# Altium project power_distrubtion.PrjPCB
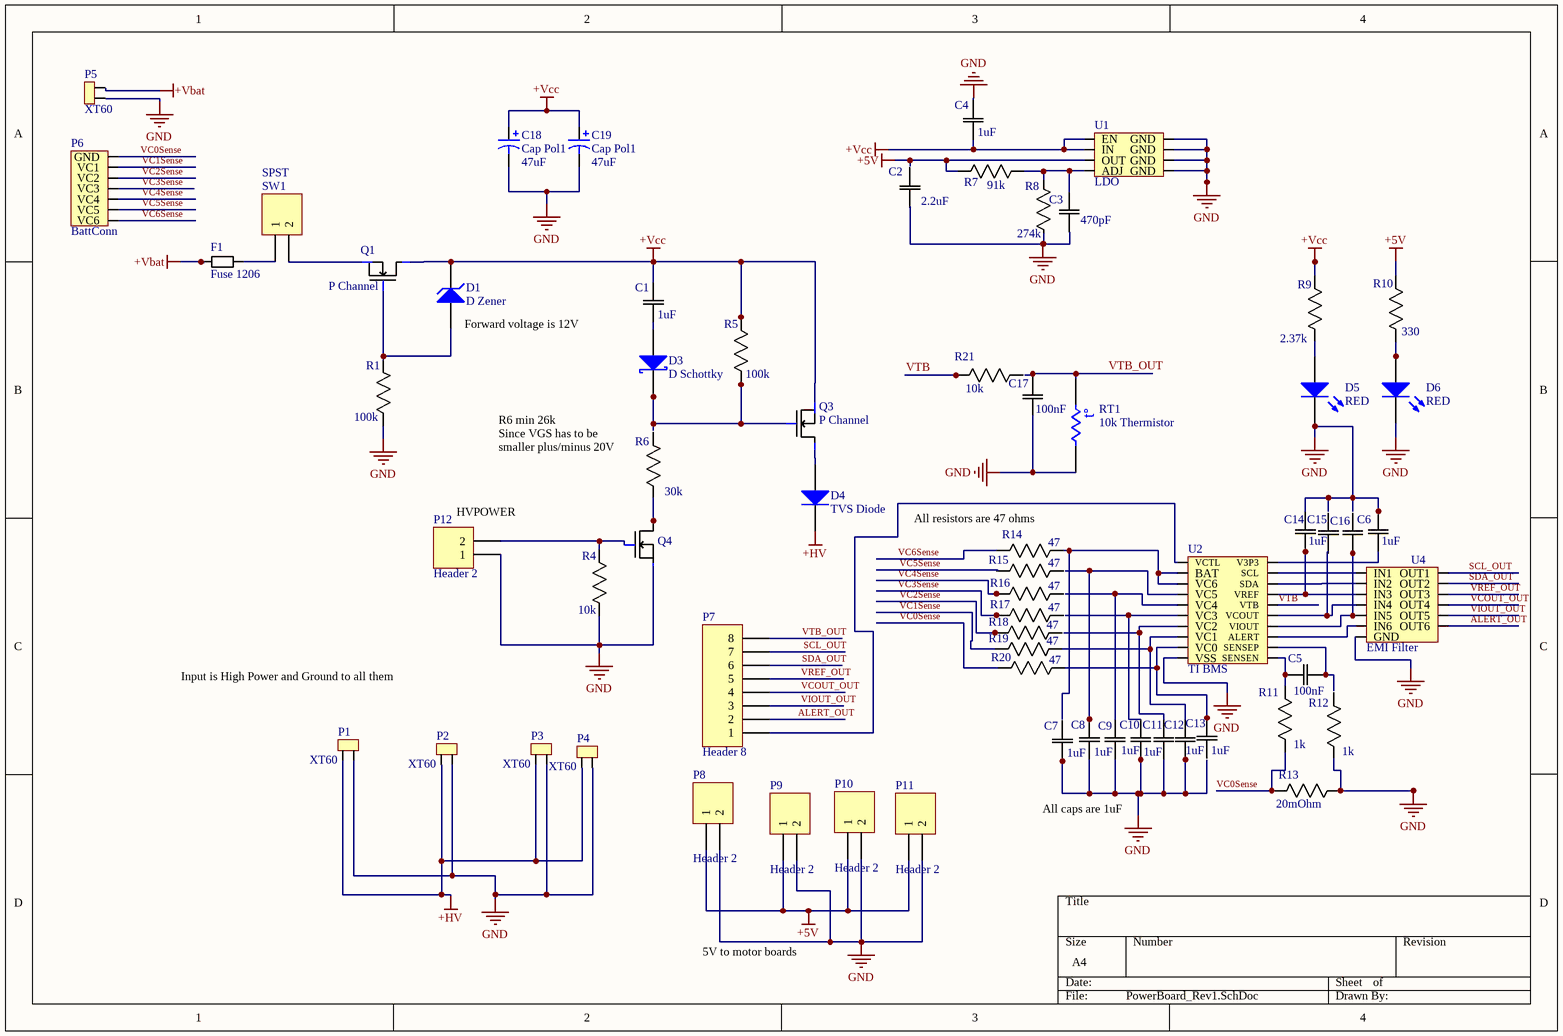
[diagram p0: PowerBoard_Rev1.SchDoc]
2 sheets, 114 parts. Net scope: global (net labels, ports and power ports of the same name join across sheets).
Board file: PowerBoard.PcbDoc
Sheets:
  PowerBoard_Rev1.SchDoc
  PowerBoard_Rev2.SchDoc

## Sheet PowerBoard_Rev1.SchDoc
size A4

### Parts
(Parts that share a designator on the sheet are numbered #1, #2 ... from top to bottom, then left to right.)
C1#1  1uF  [CAPC2013X110N]
C2  2.2uF  [CAPC2013X110N]
C3#1  470pF  [CAPC2013X110N]
C4  1uF  [CAPC2013X110N]
C5  100nF  [CAPC2013X110N]
C6#1  1uF  [CAPC2013X110N]
C7#1  1uF  [CAPC2013X110N]
C8#1  1uF  [CAPC2013X110N]
C9#1  1uF-0805  [CAPC2013X110N]  (value not drawn)
C10#1  1uF  [CAPC2013X110N]
C11#1  1uF  [CAPC2013X110N]
C12#1  1uF  [CAPC2013X110N]
C13#1  1uF  [CAPC2013X110N]
C14#1  1uF  [CAPC2013X110N]
C15#1  100nF  [CAPC2013X110N]  (value not drawn)
C16  100nF  [CAPC2013X110N]  (value not drawn)
C17  100nF  [CAPC2013X110N]
C18  Cap Pol1  value 47uF  [RB7.6-15]
C19  Cap Pol1  value 47uF  [RB7.6-15]
D1#1  D Zener  [DIODE-0.7]
D3#1  D Schottky  [SMB]
D4#1  TVS Diode  [DO-35]
D5#1  RED  [3.2X1.6X1.1]
D6  RED  [3.2X1.6X1.1]
F1#1  Fuse 1206  [Fuse1206]
P1#1  XT60  [XT60Connector]
P2  XT60  [XT60Connector]
P3#1  XT60  [XT60Connector]
P4  XT60  [XT60Connector]
P5  XT60  [XT60Connector]
P6  BattConn  [6sBattConn]
P7  Header 8  [HDR1X8]
P8  Header 2  [HDR1X2]
P9  Header 2  [HDR1X2]
P10  Header 2  [HDR1X2]
P11  Header 2  [HDR1X2]
P12  Header 2  [HDR1X2]
Q1#1  P Channel  [PChannelMosfet]
Q3  P Channel  [PChannelMosfet]
Q4  N-Channel  [SOIC127P600X170-8N]  (value not drawn)
R1  100k  [RESC2013X65N]
R4#1  10k  [RESC2013X65N]
R5#1  100k  [RESC2013X65N]
R6#1  30k  [RESC2013X65N]
R7#1  91k  [RESC2013X65N]
R8#1  274k  [RESC2013X65N]
R9#1  2.37k  [RESC2013X65N]
R10#1  330  [RESC2013X65N]
R11#1  1k  [RESC2013X65N]
R12#1  1k  [RESC2013X65N]
R13#1  20mOhm  [RESC2013X65N]
R14#1  47  [RESC2013X65N]
R15#1  47  [RESC2013X65N]
R16  47  [RESC2013X65N]
R17#1  47  [RESC2013X65N]
R18  47  [RESC2013X65N]
R19  47  [RESC2013X65N]
R20  47  [RESC2013X65N]
R21  10k  [RESC2013X65N]
RT1  10k Thermistor  [6-0805_N]
SW1  SPST  [HDR1X2]
U1#1  LDO  [SOIC127P600X170-8N]
U2  TI BMS  [TSOP65P640X120-20N]
U4#1  EMI Filter  [Filter]

### Nets
+5V: P8.1 P9.1 P10.1 P11.1 R7#1.2(R2) R10#1.1(R1) U1#1.OUT
+HV: D4#1.2(K) P1#1.1 P2.1 P3#1.1 P4.1
+Vbat: F1#1.1 P5.2
+Vcc: C1#1.2(C2) C4.1(C1) C18.1 C19.1 D1#1.2(K) Q1#1.S Q3.D R5#1.1(R1) R9#1.1(R1) U1#1.EN U1#1.IN
GND: C2.1(C1) C4.2(C2) C6#1.2(C2) C7#1.1(C1) C8#1.1(C1) C9#1.1(C1) C10#1.1(C1) C11#1.1(C1) C12#1.1(C1) C14#1.2(C2) C17.1(C1) C18.2 C19.2 D5#1.2(K) D6.2(K) P1#1.2 P2.2 P3#1.2 P4.2 P5.1 P8.2 P9.2 P10.2 P11.2 P12.1 Q4.S R1.2(R2) R4#1.2(R2) R8#1.2(R2) R12#1.2(R2) R13#1.1(R1) RT1.2 U1#1.GND U2.VSS U4#1.GND
ALERT_OUT: P7.2 U4#1.12(OUT6)
SCL_OUT: P7.7 U4#1.7(OUT1)
SDA_OUT: P7.6 U4#1.8(OUT2)
VC0Sense: P6.GND R11#1.2(R2) R13#1.2(R2) R20.2(R2)
VC1Sense: P6.VC1 R19.2(R2)
VC2Sense: P6.VC2 R18.2(R2)
VC3Sense: P6.VC3 R17#1.2(R2)
VC4Sense: P6.VC4 R16.2(R2)
VC5Sense: P6.VC5
VC6Sense: P6.VC6 R14#1.2(R2)
VCOUT_OUT: P7.4 U4#1.10(OUT4)
VIOUT_OUT: P7.3 U4#1.11(OUT5)
VREF_OUT: P7.5 U4#1.9(OUT3)
VTB: R21.1(R1) U2.VTB
VTB_OUT: C17.2(C2) P7.8 RT1.1
NetC1#1_1: C1#1.1(C1) D3#1.1(A)
NetC3#1_2: C3#1.2(C2) R7#1.1(R1) R8#1.1(R1) U1#1.ADJ/BYP(ADJ)
NetC5_1: C5.1(C1) U2.SENSEP
NetC5_2: C5.2(C2) R11#1.1(R1) U2.SENSEN
NetC6#1_1: C6#1.1(C1) U2.V3P3
NetC8#1_2: C8#1.2(C2) U2.VC5
NetC9#1_2: C9#1.2(C2) U2.VC4
NetC10#1_2: C10#1.2(C2) U2.VC3
NetC11#1_2: C11#1.2(C2) U2.VC2
NetC12#1_2: C12#1.2(C2) R19.1(R1) U2.VC1
NetC13#1_2: C13#1.2(C2) R20.1(R1) U2.VC0
NetC14#1_1: C14#1.1(C1) U2.VREF U4#1.3(IN3)
NetC16_2: C16.2(C2) U2.VIOUT U4#1.5(IN5)
NetD1#1_1: D1#1.1(A) Q1#1.G R1.1(R1)
NetD3#1_2: D3#1.2(K) Q3.G R5#1.2(R2)
NetD4#1_1: D4#1.1(A) Q3.S
NetD5#1_1: D5#1.1(A) R9#1.2(R2)
NetD6_1: D6.1(A) R10#1.2(R2)
NetF1#1_2: F1#1.2 SW1.1
NetP7_1: P7.1 U2.VCTL
NetP12_2: P12.2 Q4.G R4#1.1(R1)
NetQ1#1_D: Q1#1.D SW1.2
NetQ4_D: Q4.D R6#1.2(R2)
NetR14#1_1: R14#1.1(R1) U2.BAT U2.VC6
NetU2_ALERT: U2.ALERT U4#1.6(IN6)
NetU2_SCL: U2.SCL U4#1.1(IN1)
NetU2_SDA: U2.SDA U4#1.2(IN2)
NetU2_VCOUT: U2.VCOUT U4#1.4(IN4)

Not connected (* = marked no-connect by the designer): C2 2(C2); C3#1 1(C1); C7#1 2(C2); C13#1 1(C1); C15#1 1(C1) 2(C2); C16 1(C1); R6#1 1(R1); R12#1 1(R1); R15#1 1(R1) 2(R2); R16 1(R1); R17#1 1(R1); R18 1(R1); R21 2(R2)

### Notes on the sheet
- (near D1#1) Forward voltage is 12V
- (near R6#1) R6 min 26k
  Since VGS has to be smaller plus/minus 20V
- (near P12) HVPOWER
- (near R14#1) All resistors are 47 ohms
- Input is High Power and Ground to all them
- All caps are 1uF
- 5V to motor boards
- (in symbol Res Thermal) t°

### Library data of the parts
C1#1 C4 C6#1 C7#1 C8#1 C10#1 C11#1 C12#1 C13#1 C14#1 = CAP 1uF 0805: CAP CER 1UF 50V X7R 0805; MP: CL21B105KBFNNNE; MF: Samsung Electro-Mechanics; Tolerance: 10%; Package: 0805; Price: 0,172 CAD; Value: 1uF; Digikey: 1276-1029-1-ND; Digikey Link: https://www.digikey.ca/product-detail/en/samsung-electro-mechanics/CL21B105KBFNNNE/1276-1029-1-ND/3889115; Rating: 50V
C2 = CAP 2.2uF 0805: CAP CER 1UF 50V X7R 0805; MP: C0805C225K4RACTU; MF: KEMET; Tolerance: 10%; Rating: 16V; Package: 0805; Price: 0,461 CAD; Value: 2.2uF; Digikey: 399-3523-1-ND; Digikey Link: https://www.digikey.ca/products/en?keywords=399-3523-1-ND
C3#1 = CAP 470pF 0805: CAP CER 470PF 50V C0G/NPO 0805; MP: CC0805JRNPO9BN471; MF: Yageo; Tolerance: 5%; Package: 0805; Price: 0,135 CAD; Value: 470pF; Digikey: 311-1119-1-ND; Digikey Link: https://www.digikey.ca/products/en?keywords=311-1119-1-ND; Rating: 50V
C5 C15#1 C16 C17 = CAP 100nF 0805: CAP CER 0.1UF 50V X7R 0805; MP: CC0805KRX7R9BB104; MF: Yageo; Tolerance: 10%; Package: 0805; Price: 0,119 CAD; Value: 100nF; Digikey: 311-1140-1-ND; Digikey Link: https://www.digikey.ca/products/en?keywords=311-1140-1-ND; Rating: 50V
C9#1 = C0805C104K5RACTU: Capacitor; Ceramic; Cap; .100UF ; Tol+-10%; SMD; Vol-Rtg 50V; X7R, Tape/Reel; MP: CL21B105KBFNNNE; MF: Samsung Electro-Mechanics; Value: 1uF; Tolerance: 10%; Package: 0805 (2012 Metric); Price: 0.17300 CAD; Digikey: 1276-1029-1-ND; Rating: 50V; Digikey Link: https://www.digikey.ca/products/en?keywords=1276-1029-1-ND
C18 C19 = Cap Pol1: Polarized Capacitor (Radial); Published: 8-Jun-2000; LatestRevisionDate: 17-Jul-2002; LatestRevisionNote: Re-released for DXP Platform.; PackageReference: RB7.6-15; Publisher: Altium Limited; PackageDescription: Polarized Capacitor (Radial); 2 Leads
D1#1 = D Zener: Zener Diode 10V 1W ±5% Through Hole DO-41; MF: ON Semiconductor; MP: 1N4740ATR; Digikey: 1N4740AFSCT-ND; Digikey Link: https://www.digikey.ca/product-detail/en/on-semiconductor/1N4740ATR/1N4740AFSCT-ND/1532756; Value: 10V; Rating: 1W
D3#1 = D Schottky: Schottky Diode; Parameter 1: *
D4#1 = Diode 1N914: High Conductance Fast Diode; MF: STMicroelectronics; MP: P6KE30CA; Rating: 54V; ComponentLink1Description: Manufacturer Link; ComponentLink1URL: http://www.fairchildsemi.com/; ComponentLink2Description: Datasheet; ComponentLink2URL: http://www.fairchildsemi.com/ds/1N%2F1N4448.pdf; Digikey: 497-12048-1-ND; Digikey Link: https://www.digikey.ca/products/en?keywords=497-12048-1-ND; Price: 0.63800 CAD; Value: TVS
D5#1 D6 = LED RED SMD: Typical RED, GREEN, YELLOW, AMBER GaAs LED; MF: Lite-On Inc.; MP: LTST-C190CKT; Rating: 1.8V; Digikey: 160-1181-1-ND; Digikey Link: https://www.digikey.ca/products/en?keywords=160-1181-1-ND; Package: 0603
F1#1 = Fuse 10A 1206: 10A 32V AC 63V DC Fuse Board Mount (Cartridge Style Excluded) Surface Mount 1206 (3216 Metric); MF: Schurter Inc.; MP: 3413.0328.22; Digikey: 486-1686-1-ND; Rating: 10A; Digikey Link: https://www.digikey.ca/products/en?keywords=486-1686-1-ND
P1#1 P2 P3#1 P4 P5 = XT60 Connector: XT60 CONNECTORS FEMALE PAIR; MF: SparkFun Electronics; MP: PRT-10474; Digikey: 1568-1816-ND; Digikey Link: https://www.digikey.ca/product-detail/en/sparkfun-electronics/PRT-10474/1568-1816-ND/8258064; Package: XT60; Price: 2.13000 CAD; Value: N/A
P6 = Component_1
P7 = Header 8: Header, 8-Pin; LatestRevisionDate: 17-Jul-2002; LatestRevisionNote: Re-released for DXP Platform.; Publisher: Altium Limited
P8-P12 = Header 2: Header, 2-Pin; LatestRevisionDate: 17-Jul-2002; LatestRevisionNote: Re-released for DXP Platform.; Publisher: Altium Limited
Q1#1 Q3 = Mosfet P Channel: MF: Vishay Siliconix; MP: SI4497DY-T1-GE3; Rating: 30V 36A; Value: P-Channel; Digikey: SI4497DY-T1-GE3CT-ND; Digikey Link: https://www.digikey.ca/products/en?keywords=SI4497DY-T1-GE3CT-ND; Package: 8-SOIC; Tolerance: N/A
Q4 = Mosfet N Channel 8-SOIC: MOSFET N-CH 30V 18.5A 8-SOIC; MF: ON Semiconductor; MP: FDS8813NZ; Digikey: FDS8813NZCT-ND; Price: 1.727 CAD; Rating: 30V; Digikey Link: https://www.digikey.ca/product-detail/en/on-semiconductor/FDS8813NZ/FDS8813NZCT-ND/1626932; Package: 8-SOIC
R1 R5#1 = RES 100k 0805: RES SMD 100K OHM 1% 1/8W 0805; MP: RC0805FR-07100KL; MF: Yageo; Rating: 0.125W; Digikey: 311-100KCRCT-ND; Price: 0.058 CAD; Package: 0805; Value: 100k; Digikey Link: https://www.digikey.ca/products/en?keywords=311-100KCRCT-ND; Tolerance: 1%
R4#1 R21 = RES 10k 0805: RES SMD 10K OHM 1% 1/8W 0805; MP: RC0805FR-0710KL; MF: Yageo; Rating: 0.125W; Digikey: 311-10.0KCRCT-ND; Price: 0.061 CAD; Package: 0805; Value: 10k; Digikey Link: https://www.digikey.ca/products/en?keywords=311-10.0KCRCT-ND; Tolerance: 1%
R6#1 = RES 30k 0805: RES SMD 30K OHM 1% 1/8W 0805; MP: RC0805FR-0730KL; MF: Yageo; Rating: 0.125W; Digikey: 311-30.0KCRDKR-ND; Price: 0.061 CAD; Package: 0805; Value: 30k; Digikey Link: https://www.digikey.ca/products/en?keywords=311-30.0KCRDKR-ND; Tolerance: 1%
R7#1 = RES 91k 0805: RES SMD 91K OHM 1% 1/8W 0805; MP: RC0805FR-0791KL; MF: Yageo; Rating: 0.125W; Digikey: 311-91.0KCRCT-ND; Price: 0.061 CAD; Package: 0805; Value: 91k; Digikey Link: https://www.digikey.ca/products/en?keywords=311-91.0KCRCT-ND; Tolerance: 1%
R8#1 = RES 274k 0805: RES SMD 274K OHM 1% 1/8W 0805; MP: RC0805FR-07274KL; MF: Yageo; Rating: 0.125W; Digikey: 311-274KCRCT-ND; Price: 0.061 CAD; Package: 0805; Value: 274k; Digikey Link: https://www.digikey.ca/products/en?keywords=311-274KCRCT-ND; Tolerance: 1%
R9#1 = RES 2.37k 0805: RES SMD 2.37kOhm 1/4W 0805; MP: RK73H2ATTD2371F; MF: KOA Speer Electronics, Inc.; Rating: 0.25W; Digikey: 2019-RK73H2ATTD2371FCT-ND; Price: 0.053 CAD; Package: 0805; Value: 2.37k; Digikey Link: https://www.digikey.ca/products/en?keywords=2019-RK73H2ATTD2371FCT-ND
R10#1 = RES 330 0805: RES SMD 330 OHM 1% 1/8W 0805; MP: RC0805FR-07330RL; MF: Yageo; Rating: 0.125W; Digikey: 311-330CRCT-ND; Price: 0.061 CAD; Package: 0805; Value: 330; Digikey Link: https://www.digikey.ca/products/en?keywords=311-330CRCT-ND
R11#1 R12#1 = RES 1k 0805: RES SMD 1K OHM 5% 1/8W 0805; MP: RC0805JR-071KL; MF: Yageo; Rating: 0.125W; Digikey: 311-1.0KARCT-ND; Price: 0.048 CAD; Package: 0805; Value: 1k; Digikey Link: https://www.digikey.ca/products/en?keywords=311-1.0KARCT-ND; Tolerance: 5%
R13#1 = RES 20mOhm 0805: RES 0.02 OHM 1% 1/2W 0805; MP: ERJ-6BWFR020V; MF: Panasonic Electronic Components; Rating: 0.5W; Digikey: P.02AQCT-ND; Price: 0.088 CAD; Package: 0805; Value: 20mOhm; Digikey Link: https://www.digikey.ca/products/en?keywords=P.02AQCT-ND; Tolerance: 1%
R14#1 R15#1 R16 R17#1 R18-R20 = RES 47 0805: RES SMD 47 OHM 1% 1/8W 0805; MP: RC0805FR-0747RL; MF: Yageo; Rating: 0.125W; Digikey: 311-47.0CRCT-ND; Price: 0.061 CAD; Package: 0805; Value: 47; Digikey Link: https://www.digikey.ca/products/en?keywords=311-47.0CRCT-ND; Tolerance: 1%
RT1 = Res Thermal: 490-2456-1-ND; Published: 24-Mar-1999; LatestRevisionDate: 29-May-2009; LatestRevisionNote: IPC-7351 Footprint Added.; PackageVersion: Mar-2003; PackageReference: 6-0805; Publisher: Altium Limited; PackageDescription: Chip Resistor 0805 Case Size; Code_IPC: RESC2012
SW1 = Header 2: SPST Switch; LatestRevisionDate: 17-Jul-2002; LatestRevisionNote: Re-released for DXP Platform.; Publisher: Altium Limited
U1#1 = U?
U2 = U?: MF: Texas Instruments; MP: BQ76925PWR; Digikey: 296-29341-1-ND; Price: 3.62200 CAD; Digikey Link: https://www.digikey.ca/products/en?keywords=296-29341-1-ND
U4#1 = EMIFilter

## Sheet PowerBoard_Rev2.SchDoc
size A4
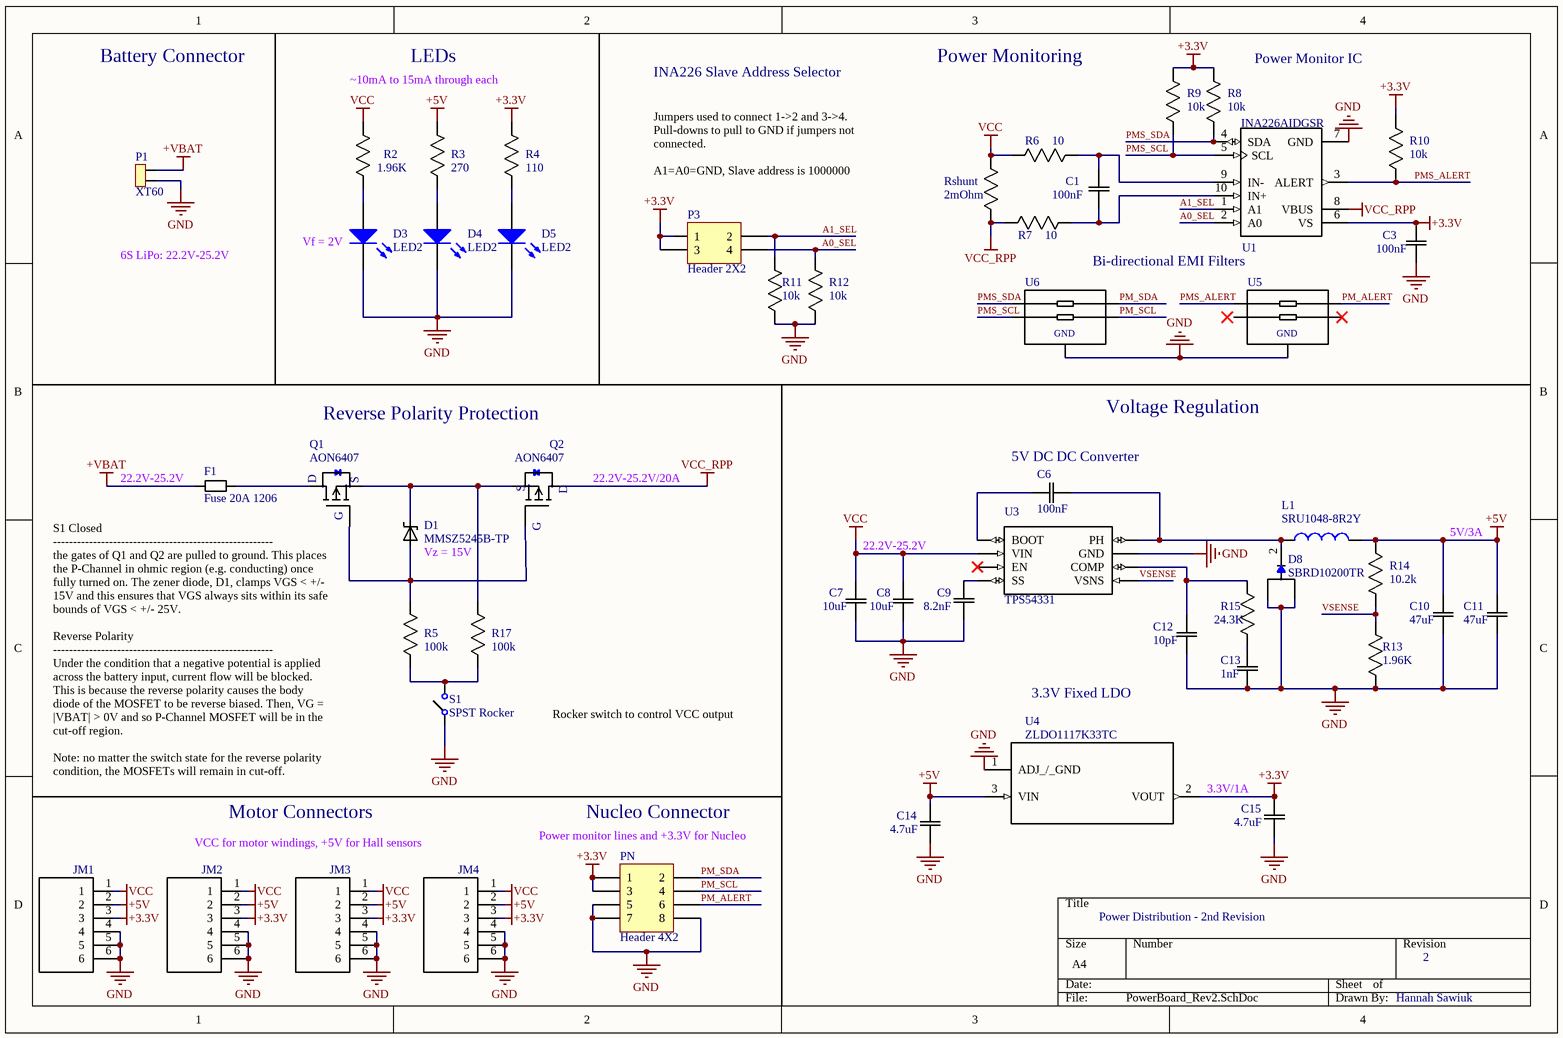
[diagram p1: PowerBoard_Rev2.SchDoc]

### Parts
(Parts that share a designator on the sheet are numbered #1, #2 ... from top to bottom, then left to right.)
C1#2  100nF  [0805]
C3#2  100nF  [0805]
C6#2  100nF  [0805]
C7#2  10uF  [1210]
C8#2  10uF  [1210]
C9#2  8.2nF  [0805]
C10#2  47uF  [1210]
C11#2  47uF  [1210]
C12#2  10pF  [0603]
C13#2  1nF  [0805]
C14#2  4.7uF  [0805]
C15#2  4.7uF  [0805]
D1#2  MMSZ5245B-TP  [SOD-123]
D3#2  LED2  [3.2X1.6X1.1]
D4#2  LED2  [3.2X1.6X1.1]
D5#2  LED2  [3.2X1.6X1.1]
D8  SBRD10200TR  [DPAK]
F1#2  Fuse 20A 1206  [1206]
JM1  CONN HEADER VERT 6POS 3.96MM  [CN HDR 6POS 3.96MM]  (value not drawn)
JM2  CONN HEADER VERT 6POS 3.96MM  [CN HDR 6POS 3.96MM]  (value not drawn)
JM3  CONN HEADER VERT 6POS 3.96MM  [CN HDR 6POS 3.96MM]  (value not drawn)
JM4  CONN HEADER VERT 6POS 3.96MM  [CN HDR 6POS 3.96MM]  (value not drawn)
L1  SRU1048-8R2Y  [Inductor]
P1#2  XT60  [XT60Connector]
P3#2  Header 2X2  [HDR2X2]
PN  Header 4X2  [HDR2X4]
Q1#2  AON6407  [8-PowerSMD]
Q2  AON6407  [8-PowerSMD]
R2  1.96K  [0805]
R3  270  [0805]
R4#2  110  [0805]
R5#2  100k  [0805]
R6#2  10  [0805]
R7#2  10  [0805]
R8#2  10k  [0805]
R9#2  10k  [0805]
R10#2  10k  [0805]
R11#2  10k  [0805]
R12#2  10k  [0805]
R13#2  1.96K  [0805]
R14#2  10.2k  [0805]
R15#2  24.3K  [0805]
R17#2  100k  [0805]
Rshunt  2mOhm  [1206]
S1  SPST Rocker  [SWITCH ROCKER SPST 10A 125V]
U1#2  INA226AIDGSR  [10-VSSOP]
U3  TPS54331  [8-PowerSOIC]
U4#2  ZLDO1117K33TC  [TO-252-3]
U5  EMI  [SOT-665]  (value not drawn)
U6  EMI  [SOT-665]  (value not drawn)

### Nets
+3.3V: C3#2.2(C2) C15#2.2(C2) JM1.3 JM2.3 JM3.3 JM4.3 P3#2.1 P3#2.3 PN.1 PN.3 R4#2.1(R1) R8#2.1(R1) R9#2.1(R1) R10#2.1(R1) U1#2.6(VS) U4#2.2(VOUT)
+5V: C10#2.2(C2) C11#2.2(C2) C14#2.2(C2) JM1.2 JM2.2 JM3.2 JM4.2 L1.2 R3.1(R1) R14#2.1(R1) U4#2.3(VIN)
+Vbat: F1#2.1 P1#2.2
GND: C3#2.1(C1) C7#2.1(C1) C8#2.1(C1) C9#2.2(C2) C10#2.1(C1) C11#2.1(C1) C12#2.1(C1) C13#2.1(C1) C14#2.1(C1) C15#2.1(C1) D3#2.2(K) D4#2.2(K) D5#2.2(K) D8.1 D8.3 JM1.4 JM1.5 JM1.6 JM2.4 JM2.5 JM2.6 JM3.4 JM3.5 JM3.6 JM4.4 JM4.5 JM4.6 P1#2.1 PN.5 PN.7 PN.8 R11#2.2(R2) R12#2.2(R2) R13#2.2(R2) S1.0 U1#2.7(GND) U3.7(GND) U4#2.1(ADJ_/_GND) U5.2(P$2) U6.2(P$2)
VCC: C7#2.2(C2) C8#2.2(C2) JM1.1 JM2.1 JM3.1 JM4.1 R2.1(R1) R6#2.2(R2) Rshunt.1(R1) U3.2(VIN)
VCC_RPP: Q2.D R7#2.2(R2) Rshunt.2(R2) U1#2.8(VBUS)
A0_SEL: P3#2.4 R12#2.1(R1) U1#2.2(A0)
A1_SEL: P3#2.2 R11#2.1(R1) U1#2.1(A1)
PM_ALERT: PN.6 U5.5(P$5)
PM_SCL: PN.4 U6.4(P$4)
PM_SDA: PN.2 U6.5(P$5)
PMS_ALERT: R10#2.2(R2) U1#2.3(ALERT) U5.1(P$1)
PMS_SCL: R9#2.2(R2) U1#2.5(SCL) U6.3(P$3)
PMS_SDA: R8#2.2(R2) U1#2.4(SDA) U6.1(P$1)
VSENSE: R13#2.1(R1) R14#2.2(R2) U3.5(VSNS)
NetC1#2_1: C1#2.1(C1) R7#2.1(R1) U1#2.10(IN+)
NetC1#2_2: C1#2.2(C2) R6#2.1(R1) U1#2.9(IN-)
NetC6#2_1: C6#2.1(C1) U3.1(BOOT)
NetC6#2_2: C6#2.2(C2) D8.2 L1.1 U3.8(PH)
NetC9#2_1: C9#2.1(C1) U3.4(SS)
NetC12#2_2: C12#2.2(C2) R15#2.1(R1) U3.6(COMP)
NetC13#2_2: C13#2.2(C2) R15#2.2(R2)
NetD1#2_A: D1#2.A Q1#2.G Q2.G R5#2.1(R1)
NetD1#2_C: D1#2.C Q1#2.S Q2.S R17#2.1(R1)
NetD3#2_1: D3#2.1(A) R2.2(R2)
NetD4#2_1: D4#2.1(A) R3.2(R2)
NetD5#2_1: D5#2.1(A) R4#2.2(R2)
NetF1#2_2: F1#2.2 Q1#2.D
NetR5#2_2: R5#2.2(R2) R17#2.2(R2) S1.1

Not connected (* = marked no-connect by the designer): U3 3(EN)* 9(PowerPAD); U5 3(P$3) 4(P$4)*

### Notes on the sheet
- Battery Connector
- ~10mA to 15mA through each
- LEDs
- INA226 Slave Address Selector
- Power Monitoring
- Power Monitor IC
- Jumpers used to connect 1->2 and 3->4. Pull-downs to pull to GND if jumpers not connected.
  A1=A0=GND, Slave address is 1000000
- (near D3#2) Vf = 2V
- 6S LiPo: 22.2V-25.2V
- Bi-directional EMI Filters
- Reverse Polarity Protection
- Voltage Regulation
- (near F1#2) 22.2V-25.2V
- (near Q2) 22.2V-25.2V/20A
- (near C6#2) 5V DC DC Converter
- (near D1#2) Vz = 15V
- 22.2V-25.2V
- 5V/3A
- Rocker switch to control VCC output
- 3.3V Fixed LDO
- (near Q1#2) S1 Closed
  -------------------------------------------------------
  the gates of Q1 and Q2 are pulled to ground. This places the P-Channel in ohmic region (e.g. conducting) once fully turned on. The zener diode, D1, clamps VGS < +/- 15V and this ensures that VGS always sits within its safe bounds of VGS < +/- 25V.
  Reverse Polarity
  -------------------------------------------------------
  Under the condition that a negative potential is applied across the battery input, current flow will be blocked. This is because the reverse polarity causes the body diode of the MOSFET to be reverse biased. Then, VG = |VBAT| > 0V and so P-Channel MOSFET will be in the cut-off region.
  Note: no matter the switch state for the reverse polarity condition, the MOSFETs will remain in cut-off.
- 3.3V/1A
- VCC for motor windings, +5V for Hall sensors
- Motor Connectors
- (near PN) Power monitor lines and +3.3V for Nucleo
- Nucleo Connector
- Power Distribution - 2nd Revision
- 2
- Hannah Sawiuk
- (in symbol IP4256CZ5-W) GND

### Library data of the parts
C1#2 C3#2 C6#2 = CAP 100nF 0805: as C5 on sheet PowerBoard_Rev1; Package: 0805; Price: 0,119 CAD; Value: 100nF; Digikey: 311-1140-1-ND; Digikey Link: https://www.digikey.ca/products/en?keywords=311-1140-1-ND; Rating: 50V
C7#2 C8#2 = CAP 10uF 1210: CAP CER 10UF 50V X7R 1210; MP: CL32B106KBJNNWE; MF: Samsung Electro-Mechanics; Tolerance: 10%; Package: 1210; Price: 0.95 CAD; Value: 10uF; Digikey: 1276-3388-1-ND; Digikey Link: https://www.digikey.ca/product-detail/en/samsung-electro-mechanics/CL32B106KBJNNWE/1276-3388-1-ND/3891474; Rating: 50V; ComponentLink1Description: digikey; ComponentLink1URL: https://www.digikey.ca/en/products/detail/kemet/C1210C106M5RACTU/4918883
C9#2 = CAP 8.2nF 0805: CAP CER 8200PF 50V X7R 0805; MP: C0805C822K5RACTU; MF: KEMET; Tolerance: 10%; Package: 0805; Price: 0,17 CAD; Value: 8.2nF; Digikey: 399-9275-1-ND; Digikey Link: https://www.digikey.ca/product-detail/en/kemet/C0805C822K5RACTU/399-9275-1-ND/3522793; Rating: 50V
C10#2 C11#2 = CAP 47uF 1210: CAP CER 47UF 6.3V X7R 1210; MP: GCM32ER70J476KE19L; MF: Murata Electronics; Tolerance: 10%; Package: 1210; Price: 1.68 CAD; Value: 47uF; Digikey: 490-4844-1-ND; Digikey Link: https://www.digikey.ca/product-detail/en/murata-electronics/GCM32ER70J476KE19L/490-4844-1-ND/1763982; Rating: 6.3V; ComponentLink1Description: digikey; ComponentLink1URL: https://www.digikey.ca/en/products/detail/kemet/C1210C106M5RACTU/4918883
C12#2 = CAP 10pF 0603: CAP CER SMD 0603 10PF 10% X7R 50; MP: C0603C100K5RAC7867; MF: KEMET; Rating: 50V; Package: 0603; Price: 0.4 CAD; Value: 10pF; Digikey: 399-17562-1-ND; Digikey Link: https://www.digikey.ca/product-detail/en/kemet/C0603C100K5RAC7867/399-17562-1-ND/8572562; Tolerance: 10%; ComponentLink1Description: digikey; ComponentLink1URL: https://www.digikey.ca/en/products/detail/kemet/C0603C100K5RAC7867/8572397
C13#2 = CAP 1nF 0805: CAP CER 1000PF 50V X7R 0805; MP: CC0805KRX7R9BB102; MF: Yageo; Tolerance: 10%; Package: 0805; Price: 0.1 CAD; Value: 1nF; Digikey: 311-1127-1-ND; Digikey Link: https://www.digikey.ca/products/en?keywords=311-1127-1-ND; Rating: 50V
C14#2 C15#2 = CAP 4.7uF 0805: CAP CER 4.7UF 25V X5R 0805; MP: CL21B475KOFNNNE; MF: Samsung Electro-Mechanics; Tolerance: 10%; Rating: 16V; Temperature Coefficient: X7R; Package: 0805; Price: 0,49 CAD; Value: 4.7uF; Digikey: 1276-2873-1-ND; Digikey Link: https://www.digikey.ca/product-detail/en/samsung-electro-mechanics/CL21B475KOFNNNE/1276-2873-1-ND/3890959
D1#2 = MMSZ5245B-TP: Zener Diode 15V 500mW ±5% Surface Mount SOD-123; MP: MMSZ5224BT1G; MF: ON Semiconductor; Price: None; SnapEDA_Link: https://www.snapeda.com/parts/MMSZ5224BT1G/ON%20Semiconductor/view-part/230941/?ref=snap; Package: SOD-123 ON Semiconductor; Availability: Unavailable; Value: *; ComponentLink1Description: digikey; ComponentLink1URL: https://www.digikey.ca/en/products/detail/micro-commercial-co/MMSZ5245B-TP/1793206
D3#2 D4#2 D5#2 = LED GREEN SMD: Typical RED, GREEN, YELLOW, AMBER GaAs LED; MF: Lite-On Inc.; MP: LTST-C191KGKT; Rating: 2V; Digikey: 160-1446-1-ND; Digikey Link: https://www.digikey.ca/products/en?keywords=160-1446-1-ND; Package: 0603
D8 = SBRD10200TR: Diode Schottky 200V 10A Surface Mount DPAK; MF: SMC Diode; MP: SBRD10200TR; SnapEDA_Link: https://www.snapeda.com/parts/SBRD10200TR/SMC%20Diode%20Solutions/view-part/702246/?ref=snap; Package: TO-252-3 SMC; ComponentLink1Description: digikey; ComponentLink1URL: https://www.digikey.ca/product-detail/en/smc-diode-solutions/SBRD10200TR/1655-1939-1-ND/8625508; Digikey: 1655-1939-1-ND; Digikey Link: https://www.digikey.ca/product-detail/en/smc-diode-solutions/SBRD10200TR/1655-1939-1-ND/8625508
F1#2 = Fuse 20A 1206: FUSE BOARD MOUNT 20A 32VAC 63VDC; MF: Schurter Inc.; MP: 3413.0331.22; Digikey: 486-1689-6-ND; Rating: 20A; Digikey Link: https://www.digikey.ca/product-detail/en/schurter-inc/3413.0331.22/486-1689-6-ND/2870024
JM1-JM4 = CONN HEADER VERT 6POS 3.96MM: Connector Header Through Hole 6 position 0.156" (3.96mm); MF: TE Connectivity; MP: 1877285-6; Current Rating: 7.5A; Voltage Rating: 250VAC; SnapEDA_Link: https://www.snapeda.com/parts/1877285-6/TE%20Connectivity/view-part/2371244/?ref=snap; Digikey: https://www.digikey.ca/product-detail/en/te-connectivity-amp-connectors/1877285-6/A99849-ND/2000097; Digikey Link: A99849-ND
L1 = SRU1048-8R2Y: FIXED IND 8.2UH 4.6A 15 MOHM SMD; MF: Bourns Inc.; MP: SRU1048-8R2Y; Price: None; Package: Nonstandard; Value: 8.2uH; ComponentLink1Description: digikey; ComponentLink1URL: https://www.digikey.ca/en/products/detail/bourns-inc/SRU1048-8R2Y/2352912; Digikey: SRU1048-8R2YCT-ND; Digikey Link: https://www.digikey.ca/en/products/detail/bourns-inc/SRU1048-8R2Y/2352912
P1#2 = XT60 Connector: as P1#1 on sheet PowerBoard_Rev1; Digikey: 1568-1816-ND; Digikey Link: https://www.digikey.ca/product-detail/en/sparkfun-electronics/PRT-10474/1568-1816-ND/8258064; Package: XT60; Price: 2.13000 CAD; Value: N/A
P3#2 = Header 2X2: Header, 2-Pin, Dual row; LatestRevisionDate: 17-Jul-2002; LatestRevisionNote: Re-released for DXP Platform.; Publisher: Altium Limited
PN = Header 4X2: Header, 4-Pin, Dual row; LatestRevisionDate: 17-Jul-2002; LatestRevisionNote: Re-released for DXP Platform.; Publisher: Altium Limited
Q1#2 Q2 = AON6407: P-Channel 30V 32A (Ta), 85A (Tc) 7.3W (Ta), 83W (Tc) Surface Mount 8-DFN (5x6); MF: Alpha & Omega Semiconductor Inc.; Package: 8-PowerSMD; MP: AON6407; Digikey: 785-1421-1-ND; Digikey Link: https://www.digikey.ca/product-detail/en/alpha-omega-semiconductor-inc/AON6407/785-1421-1-ND/3466800
R2 R13#2 = RES 1.96k 0805: RES SMD 1.96K OHM 1% 1/8W 0805; MP: ERJ-6ENF1961V; MF: Panasonic Electronic Components; Rating: 0.125W; Digikey: P1.96KCCT-ND; Price: 0.15 CAD; Package: 0805; Value: 1.96k; Digikey Link: https://www.digikey.ca/product-detail/en/panasonic-electronic-components/ERJ-6ENF1961V/P1.96KCCT-ND/119041; Tolerance: 1%
R3 = RES 270 0805: RES SMD 270 OHM 5% 1/8W 0805; MP: RC0805JR-07270RL; MF: Yageo; Rating: 0.125W; Digikey: 311-270ARCT-ND; Price: 0.054 CAD; Package: 0805; Value: 270; Digikey Link: https://www.digikey.ca/product-detail/en/yageo/RC0805JR-07270RL/311-270ARCT-ND/731238
R4#2 = RES 110 0805: RES SMD 110 OHM 1% 1/8W 0805; MP: RC0805FR-07110RL; MF: Yageo; Rating: 0.125W; Digikey: 311-110CRCT-ND; Price: 0.15 CAD; Package: 0805; Value: 110; Digikey Link: https://www.digikey.ca/product-detail/en/yageo/RC0805FR-07110RL/311-110CRCT-ND/730506; Tolerance: 1%
R5#2 R17#2 = RES 100k 0805: as R1 on sheet PowerBoard_Rev1; Digikey: 311-100KCRCT-ND; Price: 0.058 CAD; Package: 0805; Value: 100k; Digikey Link: https://www.digikey.ca/products/en?keywords=311-100KCRCT-ND; Tolerance: 1%
R6#2 R7#2 = RES 10 0805: RES SMD 10 OHM 1% 1/8W 0805; MP: RC0805FR-0710RL; MF: Yageo; Rating: 0.125W; Digikey: 311-10.0CRCT-ND; Price: 0.15 CAD; Package: 0805; Value: 10; Digikey Link: https://www.digikey.ca/product-detail/en/yageo/RC0805FR-0710RL/311-10.0CRCT-ND/730481; Tolerance: 1%
R8#2 R9#2 R10#2 R11#2 R12#2 = RES 10k 0805: as R4#1 on sheet PowerBoard_Rev1; Digikey: 311-10.0KCRCT-ND; Price: 0.061 CAD; Package: 0805; Value: 10k; Digikey Link: https://www.digikey.ca/products/en?keywords=311-10.0KCRCT-ND; Tolerance: 1%
R14#2 = RES 10.2k 0805: RES SMD 10.2K OHM 1% 1/8W 0805; MP: ERJ-6ENF1022V; MF: Panasonic Electronic Components; Rating: 0.125W; Digikey: P10.2KCCT-ND; Price: 0.15 CAD; Package: 0805; Value: 10.2k; Digikey Link: https://www.digikey.ca/product-detail/en/panasonic-electronic-components/ERJ-6ENF1022V/P10.2KCCT-ND/119251; Tolerance: 1%; ComponentLink1Description: digikey; ComponentLink1URL: https://www.digikey.ca/en/products/detail/panasonic-electronic-components/ERJ-6ENF1022V/111476
R15#2 = RES 24.3k 0805: RES SMD 24.3K OHM 1% 1/8W 0805; MP: RC0805FR-0724K3L; MF: Yageo; Rating: 0.125W; Digikey: 311-24.3KCRCT-ND; Price: 0.15 CAD; Package: 0805; Value: 24.3k; Digikey Link: https://www.digikey.ca/product-detail/en/yageo/RC0805FR-0724K3L/311-24.3KCRCT-ND/730705; Tolerance: 1%
Rshunt = RES 2mOhm 1206: RES 0.002 OHM 1% 1W 1206; MP: CSR1206-0R002F1; MF: Riedon; Value: 0.002; Rating: 0.125W; Digikey: 696-1370-1-ND; Price: 0.88 CAD; Package: 1206; Digikey Link: https://www.digikey.ca/product-detail/en/riedon/CSR1206-0R002F1/696-1370-1-ND/2813303
S1 = SWITCH ROCKER SPST 10A 125V: Rocker Switch SPST 10A (AC) 125V Panel Mount, Snap-In; MP: SRB22A2FBBNN; MF: ZF Electronics; Digikey: CH755-ND; Digikey Link: https://www.digikey.ca/product-detail/en/zf-electronics/SRB22A2FBBNN/CH755-ND/446021; Price: 1.276 CAD; Rating: 10A 125V
U1#2 = INA226AIDGSR: 36-V, Bi-Directional, Ultra-High Accuracy, Low-/High-Side, I2C Out Current/Power Monitor w/ Alert 10-VSSOP -40 to 125; MF: Texas Instruments; Price: None; MP: INA226AIDGSR; SnapEDA_Link: https://www.snapeda.com/parts/INA226AIDGSR/Texas%20Instruments/view-part/53552/?ref=snap; Package: MSOP-10 Texas Instruments; Availability: Unavailable; Value: *; Digikey: 296-29034-2-ND; Digikey Link: https://www.digikey.ca/product-detail/en/texas-instruments/INA226AIDGSR/296-29034-2-ND/2687236
U3 = TPS54331: Buck Switching Regulator IC Positive Adjustable 0.8V 1 Output 3A 8-SOIC _0.154, 3.90mm Width_; MP: TPS54331DDAR; MF: Texas Instruments; SnapEDA_Link: https://www.snapeda.com/parts/TPS54331/Texas%20Instruments/view-part/568919/?ref=snap; Package: 8-PowerSOIC; Digikey: 296-39419-1-ND; Digikey Link: https://www.digikey.ca/product-detail/en/texas-instruments/TPS54331DDAR/296-39419-1-ND/5143369
U4#2 = ZLDO1117K33TC: Linear Voltage Regulator IC Positive Fixed 1 Output  1A TO-252-3; MF: Diodes Incorporated; Package: TO-252-3; MP: ZLDO1117K33TC; Digikey: ZLDO1117K33DIDKR-ND; Digikey Link: https://www.digikey.ca/product-detail/en/diodes-incorporated/ZLDO1117K33TC/ZLDO1117K33DIDKR-ND/2095639
U5 U6 = IP4256CZ5-W: RC (Pi) EMI Filter 2nd Order Low Pass 2 Channel R = 100Ohms, C = 19pF (Total)  SOT-665; MF: Nexperia USA Inc.; MP: IP4256CZ5-W,115; SnapEDA_Link: https://www.snapeda.com/parts/IP4256CZ5-W/Nexperia%20USA%20Inc./view-part/3605439/?ref=snap; Price: 0.17 CAD; Package: SOT-665; Digikey: 1727-4718-1-ND; Digikey Link: https://www.digikey.ca/product-detail/en/nexperia-usa-inc/IP4256CZ5-W115/1727-4718-1-ND/2531158

## Nets that join several sheets
+5V: PowerBoard_Rev1 (7 pins), PowerBoard_Rev2 (11 pins)
+Vbat: PowerBoard_Rev1 (F1#1.1 P5.2), PowerBoard_Rev2 (F1#2.1 P1#2.2)
GND: PowerBoard_Rev1 (35 pins), PowerBoard_Rev2 (40 pins)